# EAGLE design main (EAGLE 8.7.1)
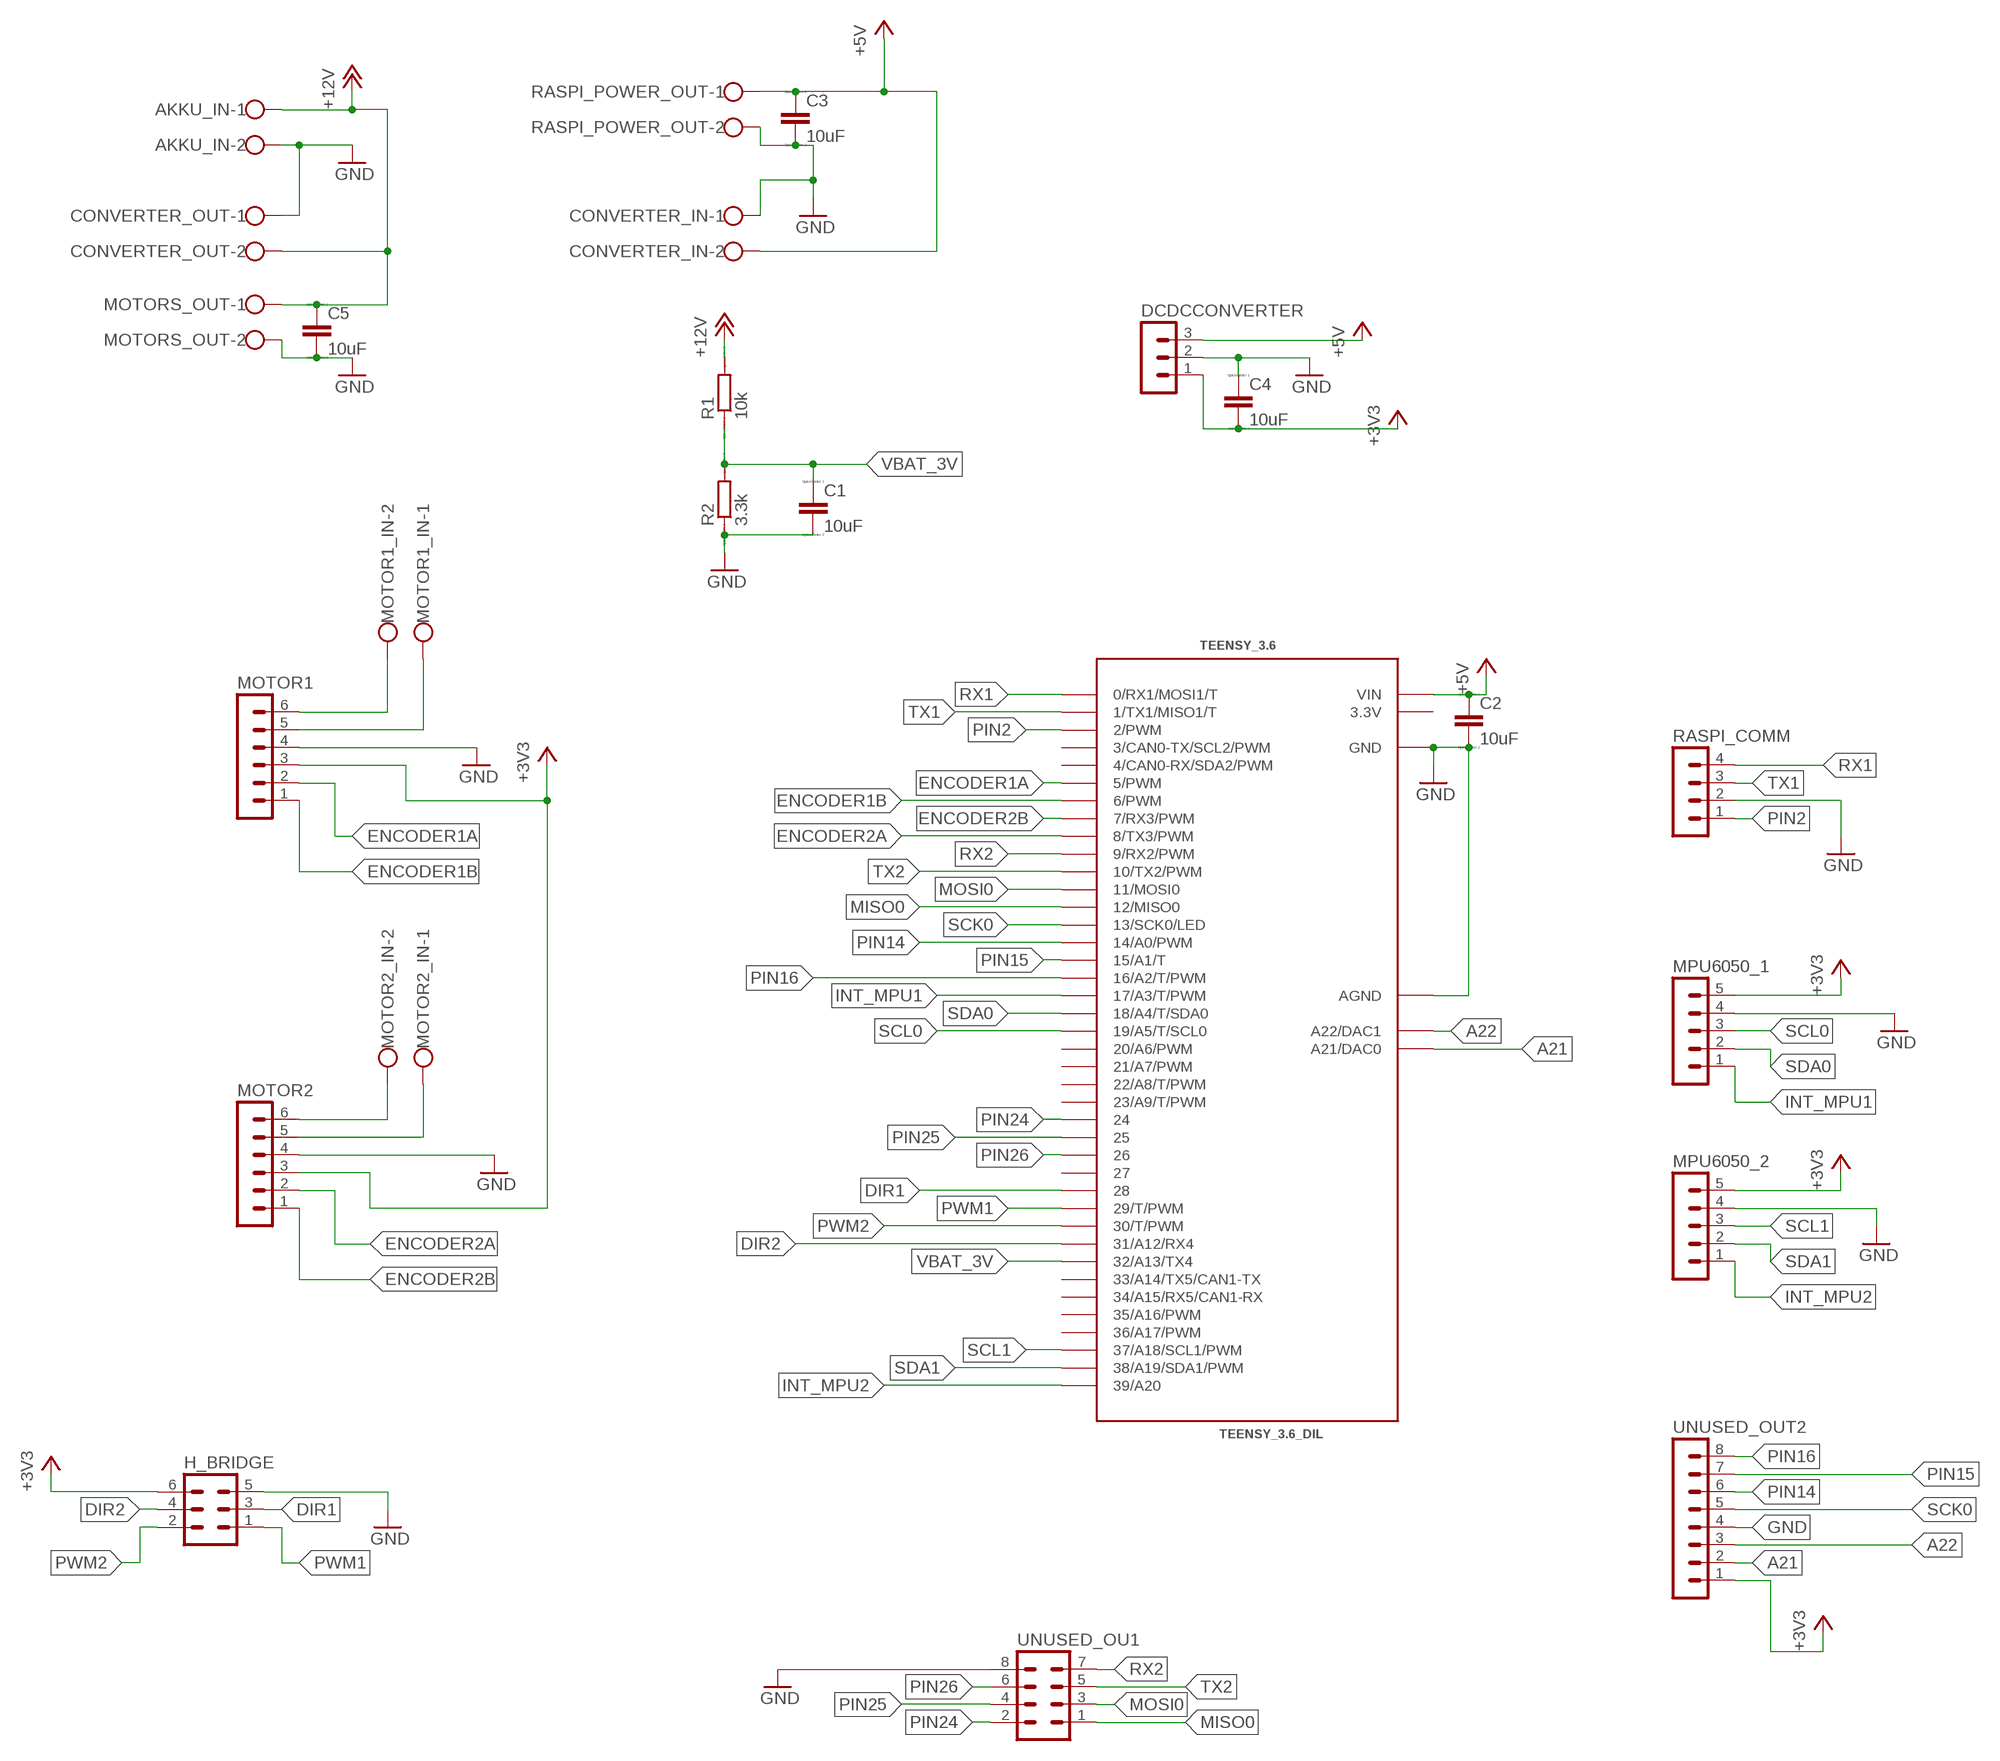
[diagram p0: schematic, sheet 1]

## Parts
AKKU_IN  W237-102  [W237-102]
C1  10uF  CC1206  [C1206]
C2  10uF  CC1206  [C1206]
C3  10uF  CC1206  [C1206]
C4  10uF  CC1206  [C1206]
C5  10uF  CC1206  [C1206]
CONVERTER_IN  W237-102  [W237-102]
CONVERTER_OUT  W237-102  [W237-102]
DCDCCONVERTER  MA03-1  [MA03-1]
H_BRIDGE  MA03-2  [MA03-2]
MOTOR1  MA06-1  [MA06-1]
MOTOR1_IN  W237-102  [W237-102]
MOTOR2  MA06-1  [MA06-1]
MOTOR2_IN  W237-102  [W237-102]
MOTORS_OUT  W237-102  [W237-102]
MPU6050_1  MA05-1  [MA05-1]
MPU6050_2  MA05-1  [MA05-1]
R1  10k  RR1206  [R1206]
R2  3.3k  RR1206  [R1206]
RASPI_COMM  MA04-1  [MA04-1]
RASPI_POWER_OUT  W237-102  [W237-102]
TEENSY_3.6  TEENSY_3.6_DIL  [TEENSY_3.6_DIL]
UNUSED_OU1  MA04-2  [MA04-2]
UNUSED_OUT2  MA08-1  [MA08-1]

## Nets
+3V3: C4.2 DCDCCONVERTER.1 H_BRIDGE.6 MOTOR1.3 MOTOR2.3 MPU6050_1.5 MPU6050_2.5 UNUSED_OUT2.1
+5V: C2.1 C3.1 CONVERTER_IN.2 DCDCCONVERTER.3 RASPI_POWER_OUT.1 TEENSY_3.6.VIN
+12V: AKKU_IN.1 C5.1 CONVERTER_OUT.2 MOTORS_OUT.1 R1.2
A21: TEENSY_3.6.A21(A21/DAC0) UNUSED_OUT2.2
A22: TEENSY_3.6.A22(A22/DAC1) UNUSED_OUT2.3
DIR1: H_BRIDGE.3 TEENSY_3.6.28
DIR2: H_BRIDGE.4 TEENSY_3.6.31/A12(31/A12/RX4)
ENCODER1A: MOTOR1.2 TEENSY_3.6.5(5/PWM)
ENCODER1B: MOTOR1.1 TEENSY_3.6.6(6/PWM)
ENCODER2A: MOTOR2.2 TEENSY_3.6.8(8/TX3/PWM)
ENCODER2B: MOTOR2.1 TEENSY_3.6.7(7/RX3/PWM)
GND: AKKU_IN.2 C1.2 C2.2 C3.2 C4.1 C5.2 CONVERTER_IN.1 CONVERTER_OUT.1 DCDCCONVERTER.2 H_BRIDGE.5 MOTOR1.4 MOTOR2.4 MOTORS_OUT.2 MPU6050_1.4 MPU6050_2.4 R2.1 RASPI_COMM.2 RASPI_POWER_OUT.2 TEENSY_3.6.AGND TEENSY_3.6.GND TEENSY_3.6.GND1(GND) UNUSED_OU1.8 UNUSED_OUT2.4
INT_MPU1: MPU6050_1.1 TEENSY_3.6.17/A3(17/A3/T/PWM)
INT_MPU2: MPU6050_2.1 TEENSY_3.6.39/A20
MISO0: TEENSY_3.6.12(12/MISO0) UNUSED_OU1.1
MOSI0: TEENSY_3.6.11(11/MOSI0) UNUSED_OU1.3
MOTOR1+: MOTOR1.6 MOTOR1_IN.2
MOTOR1-: MOTOR1.5 MOTOR1_IN.1
MOTOR2+: MOTOR2.6 MOTOR2_IN.2
MOTOR2-: MOTOR2.5 MOTOR2_IN.1
PIN2: RASPI_COMM.1 TEENSY_3.6.2(2/PWM)
PIN14: TEENSY_3.6.14/A0(14/A0/PWM) UNUSED_OUT2.6
PIN15: TEENSY_3.6.15/A1(15/A1/T) UNUSED_OUT2.7
PIN16: TEENSY_3.6.16/A2(16/A2/T/PWM) UNUSED_OUT2.8
PIN24: TEENSY_3.6.24 UNUSED_OU1.2
PIN25: TEENSY_3.6.25 UNUSED_OU1.4
PIN26: TEENSY_3.6.26 UNUSED_OU1.6
PWM1: H_BRIDGE.1 TEENSY_3.6.29(29/T/PWM)
PWM2: H_BRIDGE.2 TEENSY_3.6.30(30/T/PWM)
RX1: RASPI_COMM.4 TEENSY_3.6.0(0/RX1/MOSI1/T)
RX2: TEENSY_3.6.9(9/RX2/PWM) UNUSED_OU1.7
SCK0: TEENSY_3.6.13(13/SCK0/LED) UNUSED_OUT2.5
SCL0: MPU6050_1.3 TEENSY_3.6.19/A5(19/A5/T/SCL0)
SCL1: MPU6050_2.3 TEENSY_3.6.37/A18(37/A18/SCL1/PWM)
SDA0: MPU6050_1.2 TEENSY_3.6.18/A4(18/A4/T/SDA0)
SDA1: MPU6050_2.2 TEENSY_3.6.38/A19(38/A19/SDA1/PWM)
TX1: RASPI_COMM.3 TEENSY_3.6.1(1/TX1/MISO1/T)
TX2: TEENSY_3.6.10(10/TX2/PWM) UNUSED_OU1.5
VBAT_3V: C1.1 R1.1 R2.2 TEENSY_3.6.32/A13(32/A13/TX4)
Unconnected: TEENSY_3.6.3(3/CAN0-TX/SCL2/PWM) TEENSY_3.6.4(4/CAN0-RX/SDA2/PWM) TEENSY_3.6.20/A6(20/A6/PWM) TEENSY_3.6.21/A7(21/A7/PWM) TEENSY_3.6.22/A8(22/A8/T/PWM) TEENSY_3.6.23/A9(23/A9/T/PWM) TEENSY_3.6.27 TEENSY_3.6.33/A14(33/A14/TX5/CAN1-TX) TEENSY_3.6.34/A15(34/A15/RX5/CAN1-RX) TEENSY_3.6.35/A16(35/A16/PWM) TEENSY_3.6.36/A17(36/A17/PWM)

## Power pins joined to a net without a drawn wire
3.3V: TEENSY_3.6.3.3V TEENSY_3.6.3.3V3(3.3V)

## Library data of the parts
AKKU_IN CONVERTER_IN CONVERTER_OUT MOTOR1_IN MOTOR2_IN MOTORS_OUT RASPI_POWER_OUT = con-wago-500:W237-102: WAGO SCREW CLAMP; MPN: 237-102; OC_FARNELL: unknown; OC_NEWARK: 70K9898
C1-C5 = eagle-ltspice:C: CAPACITOR, European symbol; SPICEMODEL: NONE; SPICEPREFIX: C
DCDCCONVERTER = con-lstb:MA03-1: PIN HEADER; OC_FARNELL: unknown; OC_NEWARK: unknown
H_BRIDGE = con-lstb:MA03-2: PIN HEADER; OC_FARNELL: unknown; OC_NEWARK: unknown
MOTOR1 MOTOR2 = con-lstb:MA06-1: PIN HEADER; OC_FARNELL: unknown; OC_NEWARK: unknown
MPU6050_1 MPU6050_2 = con-lstb:MA05-1: PIN HEADER; OC_FARNELL: unknown; OC_NEWARK: unknown
R1 R2 = eagle-ltspice:R: RESISTOR, European symbol; SPICEMODEL: NONE; SPICEPREFIX: R
RASPI_COMM = con-lstb:MA04-1: PIN HEADER; OC_FARNELL: unknown; OC_NEWARK: unknown
TEENSY_3.6 = Teensy_3_and_LC_Series_Boards_v1.4:TEENSY_3.6_DIL: Teensy 3.6 DIL Package
UNUSED_OU1 = con-lstb:MA04-2: PIN HEADER; OC_FARNELL: unknown; OC_NEWARK: unknown
UNUSED_OUT2 = con-lstb:MA08-1: PIN HEADER; OC_FARNELL: unknown; OC_NEWARK: unknown

## Board
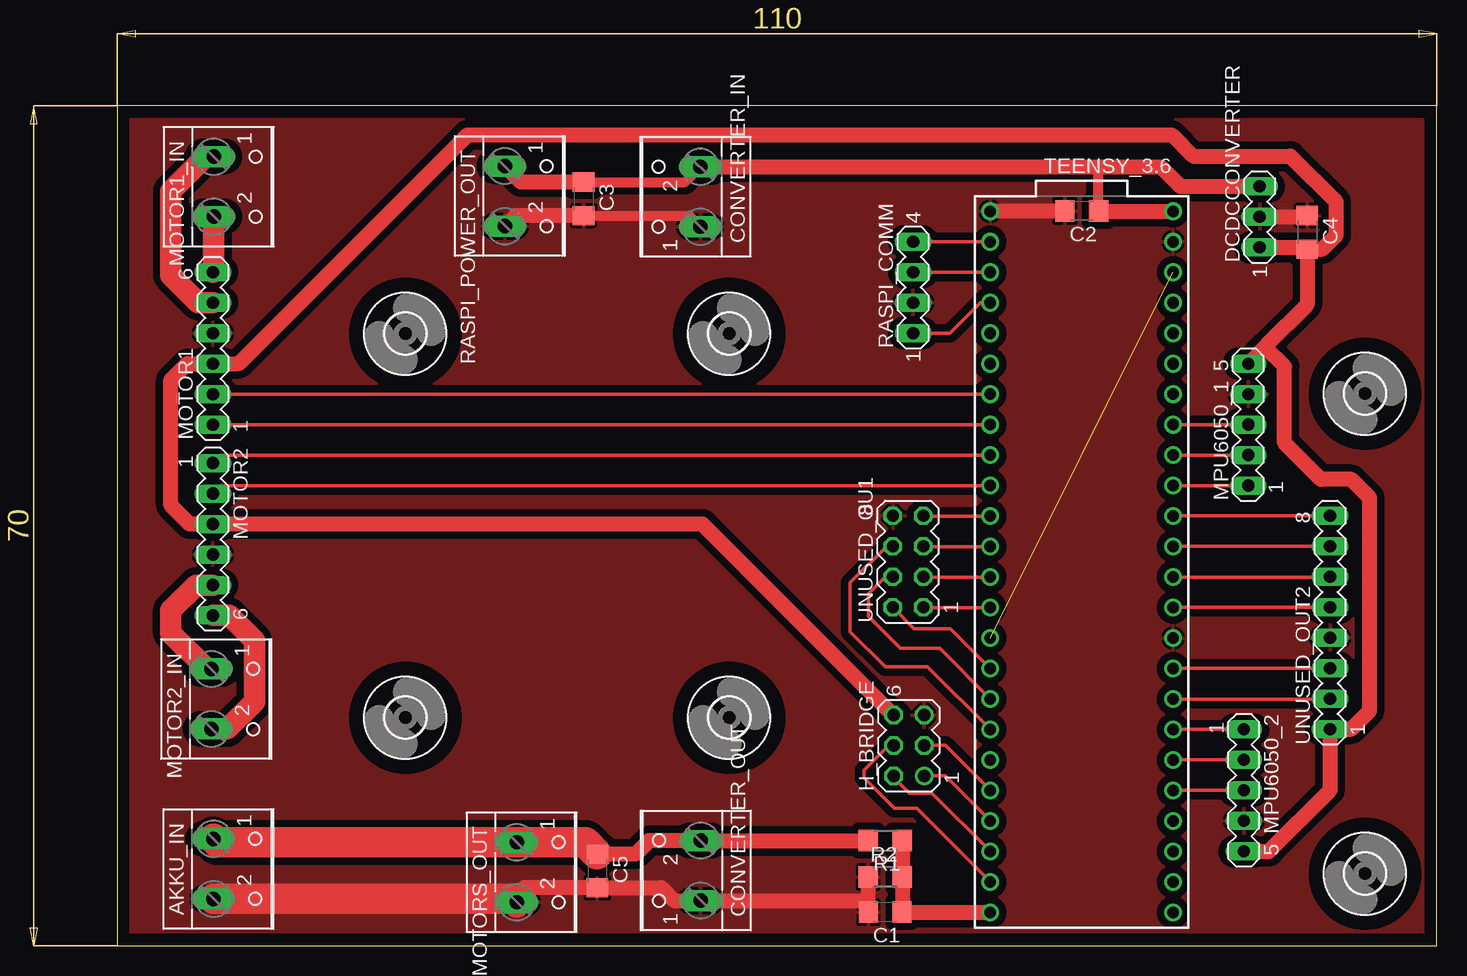
[diagram p1: board, top side]
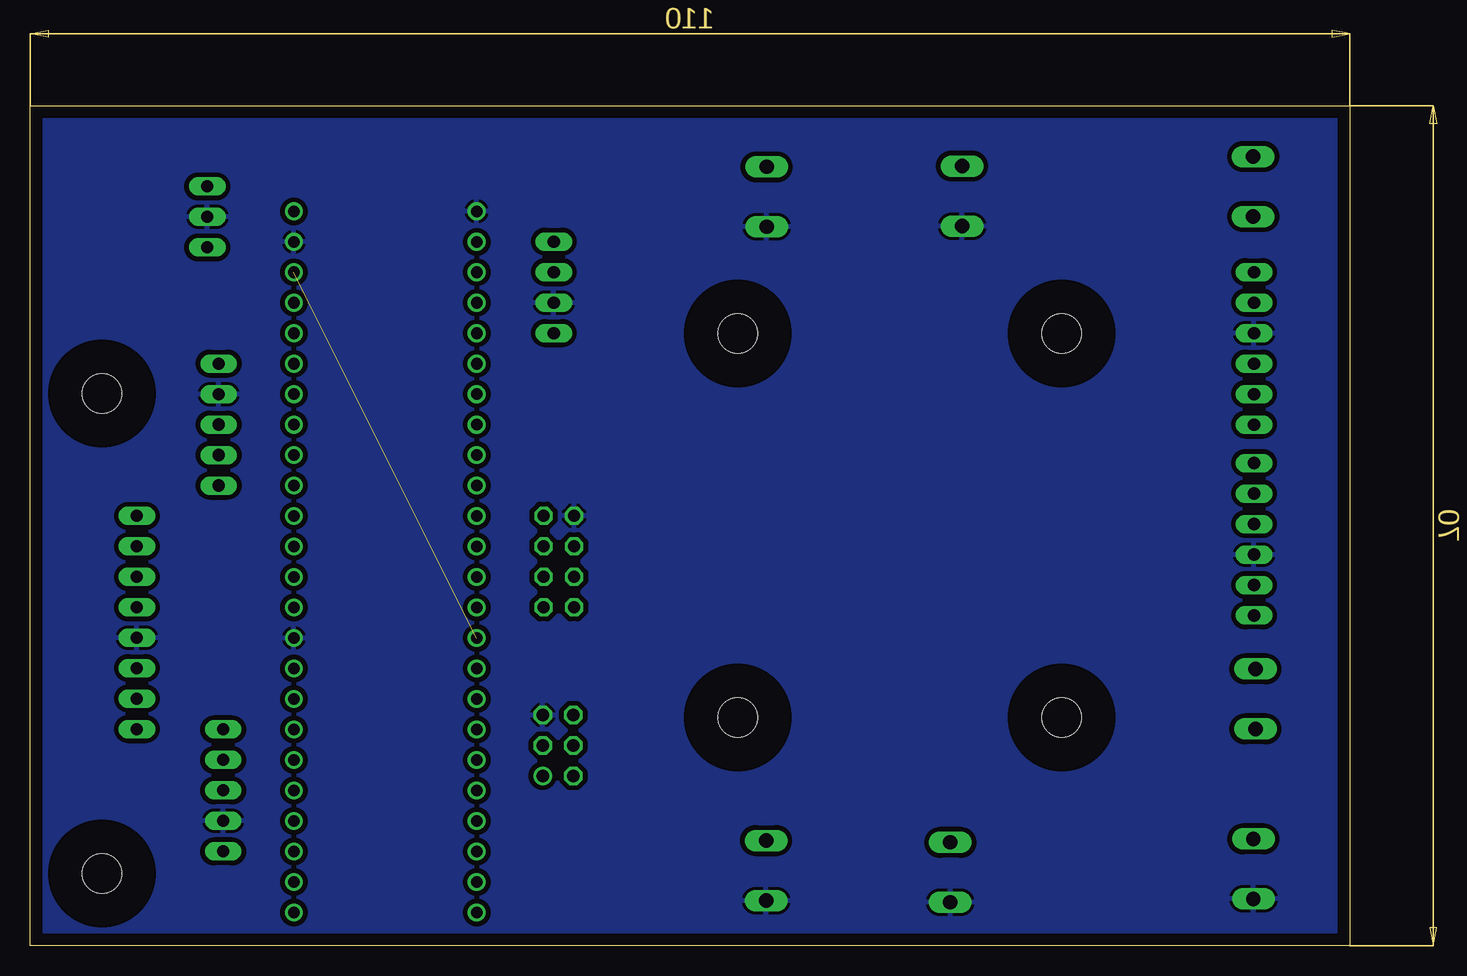
[diagram p2: board, bottom side, seen from below]

Size 110 x 70 mm. Coordinates in mm from the lower left corner, seen from the top.
Outline: 0,0 110,0 110,70 0,70 0,0
Copper layers (1*16): Top 0.035mm / dielectric 1.5mm / Bottom 0.035mm
Design rules "default": minimum track width 6mil, minimum drill 0.35mm, track to track 6mil, track to pad 6mil, pad to pad 6mil, via to via 6mil, smd to smd 6mil, copper to edge 40mil, drill to drill 6mil, minimum pad ring 10mil, minimum via ring 8mil, stop-mask expansion 4mil, vias tented up to drill 0mil, thermal gap 10mil

### Footprints (pad centres in the part's own frame; a part is rotated, then mirrored left to right if it is on the bottom)
W237-102 = drill 1.194 long: 1 -2.5,-1.27; 2 2.5,-1.27
C1206 = smd 1.6 x 1.8: 1 -1.4,0; 2 1.4,0
MA03-1 = drill 1.016 long: 1 -2.54,0; 2 0,0; 3 2.54,0
MA03-2 = drill 1.016: 1 -2.54,-1.27 | drill 1.016 octagon: 2 -2.54,1.27; 3 0,-1.27; 4 0,1.27; 5 2.54,-1.27; 6 2.54,1.27
MA06-1 = drill 1.016 long: 1 -6.35,0; 2 -3.81,0; 3 -1.27,0; 4 1.27,0; 5 3.81,0; 6 6.35,0
MA05-1 = drill 1.016 long: 1 -5.08,0; 2 -2.54,0; 3 0,0; 4 2.54,0; 5 5.08,0
R1206 = smd 1.6 x 1.803: 1 -1.422,0; 2 1.422,0
MA04-1 = drill 1.016 long: 1 -3.81,0; 2 -1.27,0; 3 1.27,0; 4 3.81,0
TEENSY_3.6_DIL = drill 0.965: 0 -7.62,25.4; 1 -7.62,22.86; 2 -7.62,20.32; 3 -7.62,17.78; 3.3V 7.62,22.86; 3.3V3 -7.62,-7.62; 4 -7.62,15.24; 5 -7.62,12.7; 6 -7.62,10.16; 7 -7.62,7.62; 8 -7.62,5.08; 9 -7.62,2.54; 10 -7.62,0; 11 -7.62,-2.54; 12 -7.62,-5.08; 13 7.62,-5.08; 14/A0 7.62,-2.54; 15/A1 7.62,0; 16/A2 7.62,2.54; 17/A3 7.62,5.08; 18/A4 7.62,7.62; 19/A5 7.62,10.16; 20/A6 7.62,12.7; 21/A7 7.62,15.24; 22/A8 7.62,17.78; 23/A9 7.62,20.32; 24 -7.62,-10.16; 25 -7.62,-12.7; 26 -7.62,-15.24; 27 -7.62,-17.78; 28 -7.62,-20.32; 29 -7.62,-22.86; 30 -7.62,-25.4; 31/A12 -7.62,-27.94; 32/A13 -7.62,-30.48; 33/A14 7.62,-30.48; 34/A15 7.62,-27.94; 35/A16 7.62,-25.4; 36/A17 7.62,-22.86; 37/A18 7.62,-20.32; 38/A19 7.62,-17.78; 39/A20 7.62,-15.24; A21 7.62,-12.7; A22 7.62,-10.16; AGND 7.62,25.4; GND -7.62,27.94; GND1 7.62,-7.62; VIN 7.62,27.94
3,3 = hole 3.3: 0,0
MA04-2 = drill 1.016 octagon: 1 -3.81,-1.27; 2 -3.81,1.27; 3 -1.27,-1.27; 4 -1.27,1.27; 5 1.27,-1.27; 6 1.27,1.27; 7 3.81,-1.27; 8 3.81,1.27
MA08-1 = drill 1.016 long: 1 -8.89,0; 2 -6.35,0; 3 -3.81,0; 4 -1.27,0; 5 1.27,0; 6 3.81,0; 7 6.35,0; 8 8.89,0

### Placement (x,y rotation side)
AKKU_IN  9.29,6.39 270 top
C1  64.01,2.79 180 top
C2  80.39,61.21 180 top
C3  38.86,62.23 270 top
C4  99.19,59.44 270 top
C5  40.01,6.22 270 top
CONVERTER_IN  47.32,62.4 90 top
CONVERTER_OUT  47.36,6.26 90 top
DCDCCONVERTER  95.22,60.73 90 top
H_BRIDGE  65.98,16.68 90 top
MOTOR1  7.96,49.77 90 top
MOTOR1_IN  9.31,63.24 270 top
MOTOR2  7.96,33.86 270 top
MOTOR2_IN  9.11,20.55 270 top
MOTORS_OUT  34.56,6.11 270 top
MPU6050_1  94.28,43.42 90 top
MPU6050_2  93.89,12.94 270 top
R1  64.01,8.76 180 top
R2  64.01,5.71 0 top
RASPI_COMM  66.34,54.85 90 top
RASPI_POWER_OUT  33.57,62.46 270 top
TEENSY_3.6  80.39,33.25 0 top
U$1  [3,3]  24,19 0 top
U$2  [3,3]  51,19 0 top
U$3  [3,3]  51,51 0 top
U$4  [3,3]  24,51 0 top
U$5  [3,3]  104,46 0 top
U$6  [3,3]  104,6 0 top
UNUSED_OU1  65.91,32 90 top
UNUSED_OUT2  101.09,26.92 90 top

### Tracks (layer width: path | path; a pad name or v marks a point on that pad's centre or on a via)
3.3V  (1 unrouted)
+3V3
  Top 1.27: H_BRIDGE.6 48.8,35.13 MOTOR2.3 6.02,35.13 4.45,36.7 4.45,47.12 5.82,48.5 MOTOR1.3 10.12,48.5 29.19,67.56 87.88,67.56 89.66,65.79 97.79,65.79 101.6,61.98 101.6,59.18 100.45,58.04 C4.2 | DCDCCONVERTER.1 99.03,58.19 C4.2 | C4.2 99.19,53.41 95.79,50.01 | 95.79,50.01 MPU6050_1.5 | MPU6050_2.5 96,7.86 101.09,12.95 UNUSED_OUT2.1 102.87,18.03 104.39,19.56 104.39,37.34 102.87,38.86 100.33,38.86 97.28,41.91 97.28,48.26 95.79,49.76 95.79,50.01
+5V
  Top 0.813: C3.1 47.32,63.63 CONVERTER_IN.2 | C2.1 81.79,64.9
  Top 1.27: DCDCCONVERTER.3 88.62,63.27 86.99,64.9 81.79,64.9 CONVERTER_IN.2 | C3.1 33.63,63.63 RASPI_POWER_OUT.1 | C2.1 87.98,61.21 TEENSY_3.6.VIN
+12V
  Top 1.27: C5.1 43.18,7.62 44.32,8.76 CONVERTER_OUT.2 R1.2
  Top 2.54: AKKU_IN.1 8.3,8.61 MOTORS_OUT.1 39.02,8.61 C5.1
A21
  Top 0.305: TEENSY_3.6.A21 101.07,20.55 UNUSED_OUT2.2
A22
  Top 0.305: TEENSY_3.6.A22 88.03,23.11 UNUSED_OUT2.3
DIR1
  Top 0.305: H_BRIDGE.3 69.02,16.68 TEENSY_3.6.28
DIR2
  Top 0.305: TEENSY_3.6.31/A12 66.64,11.43 64.77,11.43 62.23,13.97 62.23,14.61 64.3,16.68 H_BRIDGE.4
ENCODER1A
  Top 0.305: TEENSY_3.6.5 MOTOR1.2
ENCODER1B
  Top 0.305: TEENSY_3.6.6 MOTOR1.1
ENCODER2A
  Top 0.305: TEENSY_3.6.8 8.62,38.33 MOTOR2.2
ENCODER2B
  Top 0.305: TEENSY_3.6.7 8.62,40.87 MOTOR2.1
GND
  Top 0.813: C3.2 47.66,60.83 CONVERTER_IN.1
  Top 1.27: C1.2 62.61,3.81 | 62.61,3.81 62.61,5.69 R2.1 | 62.61,3.81 62.55,3.76 CONVERTER_OUT.1 46.41,3.76 45.34,4.82 C5.2 33.94,4.82 33.01,3.89 | DCDCCONVERTER.2 99.08,60.73 C4.1 | C3.2 33.17,60.83 RASPI_POWER_OUT.2 | C2.2 72.79,61.21 TEENSY_3.6.GND
  Top 2.54: AKKU_IN.2 33.01,3.89 MOTORS_OUT.2
  pour Bottom (isolate 0.406): -1.52,71.63 112.14,71.63 112.14,-2.03 -1.65,-2.03 -1.65,6.48
  pour Top (isolate 0.61): -2.79,73.15 113.79,73.15 113.79,-3.56 -3.81,-3.56 -3.81,-3.3
INT_MPU1
  Top 0.305: MPU6050_1.1 TEENSY_3.6.17/A3
INT_MPU2
  Top 0.305: TEENSY_3.6.39/A20 MPU6050_2.1
MISO0
  Top 0.305: TEENSY_3.6.12 67.21,28.17 UNUSED_OU1.1
MOSI0
  Top 0.305: TEENSY_3.6.11 67.21,30.71 UNUSED_OU1.3
MOTOR1+
  Top 1.778: MOTOR1_IN.2 8.04,56.19 MOTOR1.6
MOTOR1-
  Top 1.778: MOTOR1_IN.1 7.33,65.75 4.45,62.87 4.45,55.88 6.75,53.58 MOTOR1.5
MOTOR2+
  Top 1.778: MOTOR2_IN.2 9.16,18.05 11.43,20.32 11.43,25.4 9.32,27.51 MOTOR2.6
MOTOR2-
  Top 1.778: MOTOR2_IN.1 7.43,23.05 4.45,26.04 4.45,27.94 6.55,30.05 MOTOR2.5
PIN2
  Top 0.305: RASPI_COMM.1 69.41,51.04 71.94,53.57 TEENSY_3.6.2
PIN14
  Top 0.305: 88.03,30.73 TEENSY_3.6.14/A0 101.07,30.71 UNUSED_OUT2.6
PIN15
  Top 0.305: UNUSED_OUT2.7 88.03,33.27 TEENSY_3.6.15/A1
PIN16
  Top 0.305: UNUSED_OUT2.8 88.03,35.81 TEENSY_3.6.16/A2
PIN24
  Top 0.305: UNUSED_OU1.2 66.42,26.42 69.44,26.42 TEENSY_3.6.24
PIN25
  Top 0.305: TEENSY_3.6.25 68.55,24.77 65.28,24.77 62.61,27.43 62.61,29.34 64.01,30.73 UNUSED_OU1.4
PIN26
  Top 0.305: TEENSY_3.6.26 67.53,23.24 64.01,23.24 61.09,26.16 61.09,30.23 64.14,33.27 UNUSED_OU1.6
PWM1
  Top 0.305: H_BRIDGE.1 69.02,14.14 TEENSY_3.6.29
PWM2
  Top 0.305: TEENSY_3.6.30 67.92,12.7 66.04,12.7 64.71,14.03 H_BRIDGE.2
RX1
  Top 0.305: RASPI_COMM.4 72.76,58.66 TEENSY_3.6.0
RX2
  Top 0.305: UNUSED_OU1.7 67.21,35.79 TEENSY_3.6.9
SCK0
  Top 0.305: UNUSED_OUT2.5 88.03,28.19 TEENSY_3.6.13
SCL0
  Top 0.305: MPU6050_1.3 TEENSY_3.6.19/A5
SCL1
  Top 0.305: TEENSY_3.6.37/A18 MPU6050_2.3
SDA0
  Top 0.305: MPU6050_1.2 TEENSY_3.6.18/A4
SDA1
  Top 0.305: MPU6050_2.2 TEENSY_3.6.38/A19
TX1
  Top 0.305: TEENSY_3.6.1 RASPI_COMM.3
TX2
  Top 0.305: TEENSY_3.6.10 67.21,33.25 UNUSED_OU1.5
VBAT_3V
  Top 1.27: R1.1 R2.2 65.43,2.82 C1.1 72.74,2.79 TEENSY_3.6.32/A13